# EAGLE schematic MSSRP-BATT (EAGLE 6.6.0)
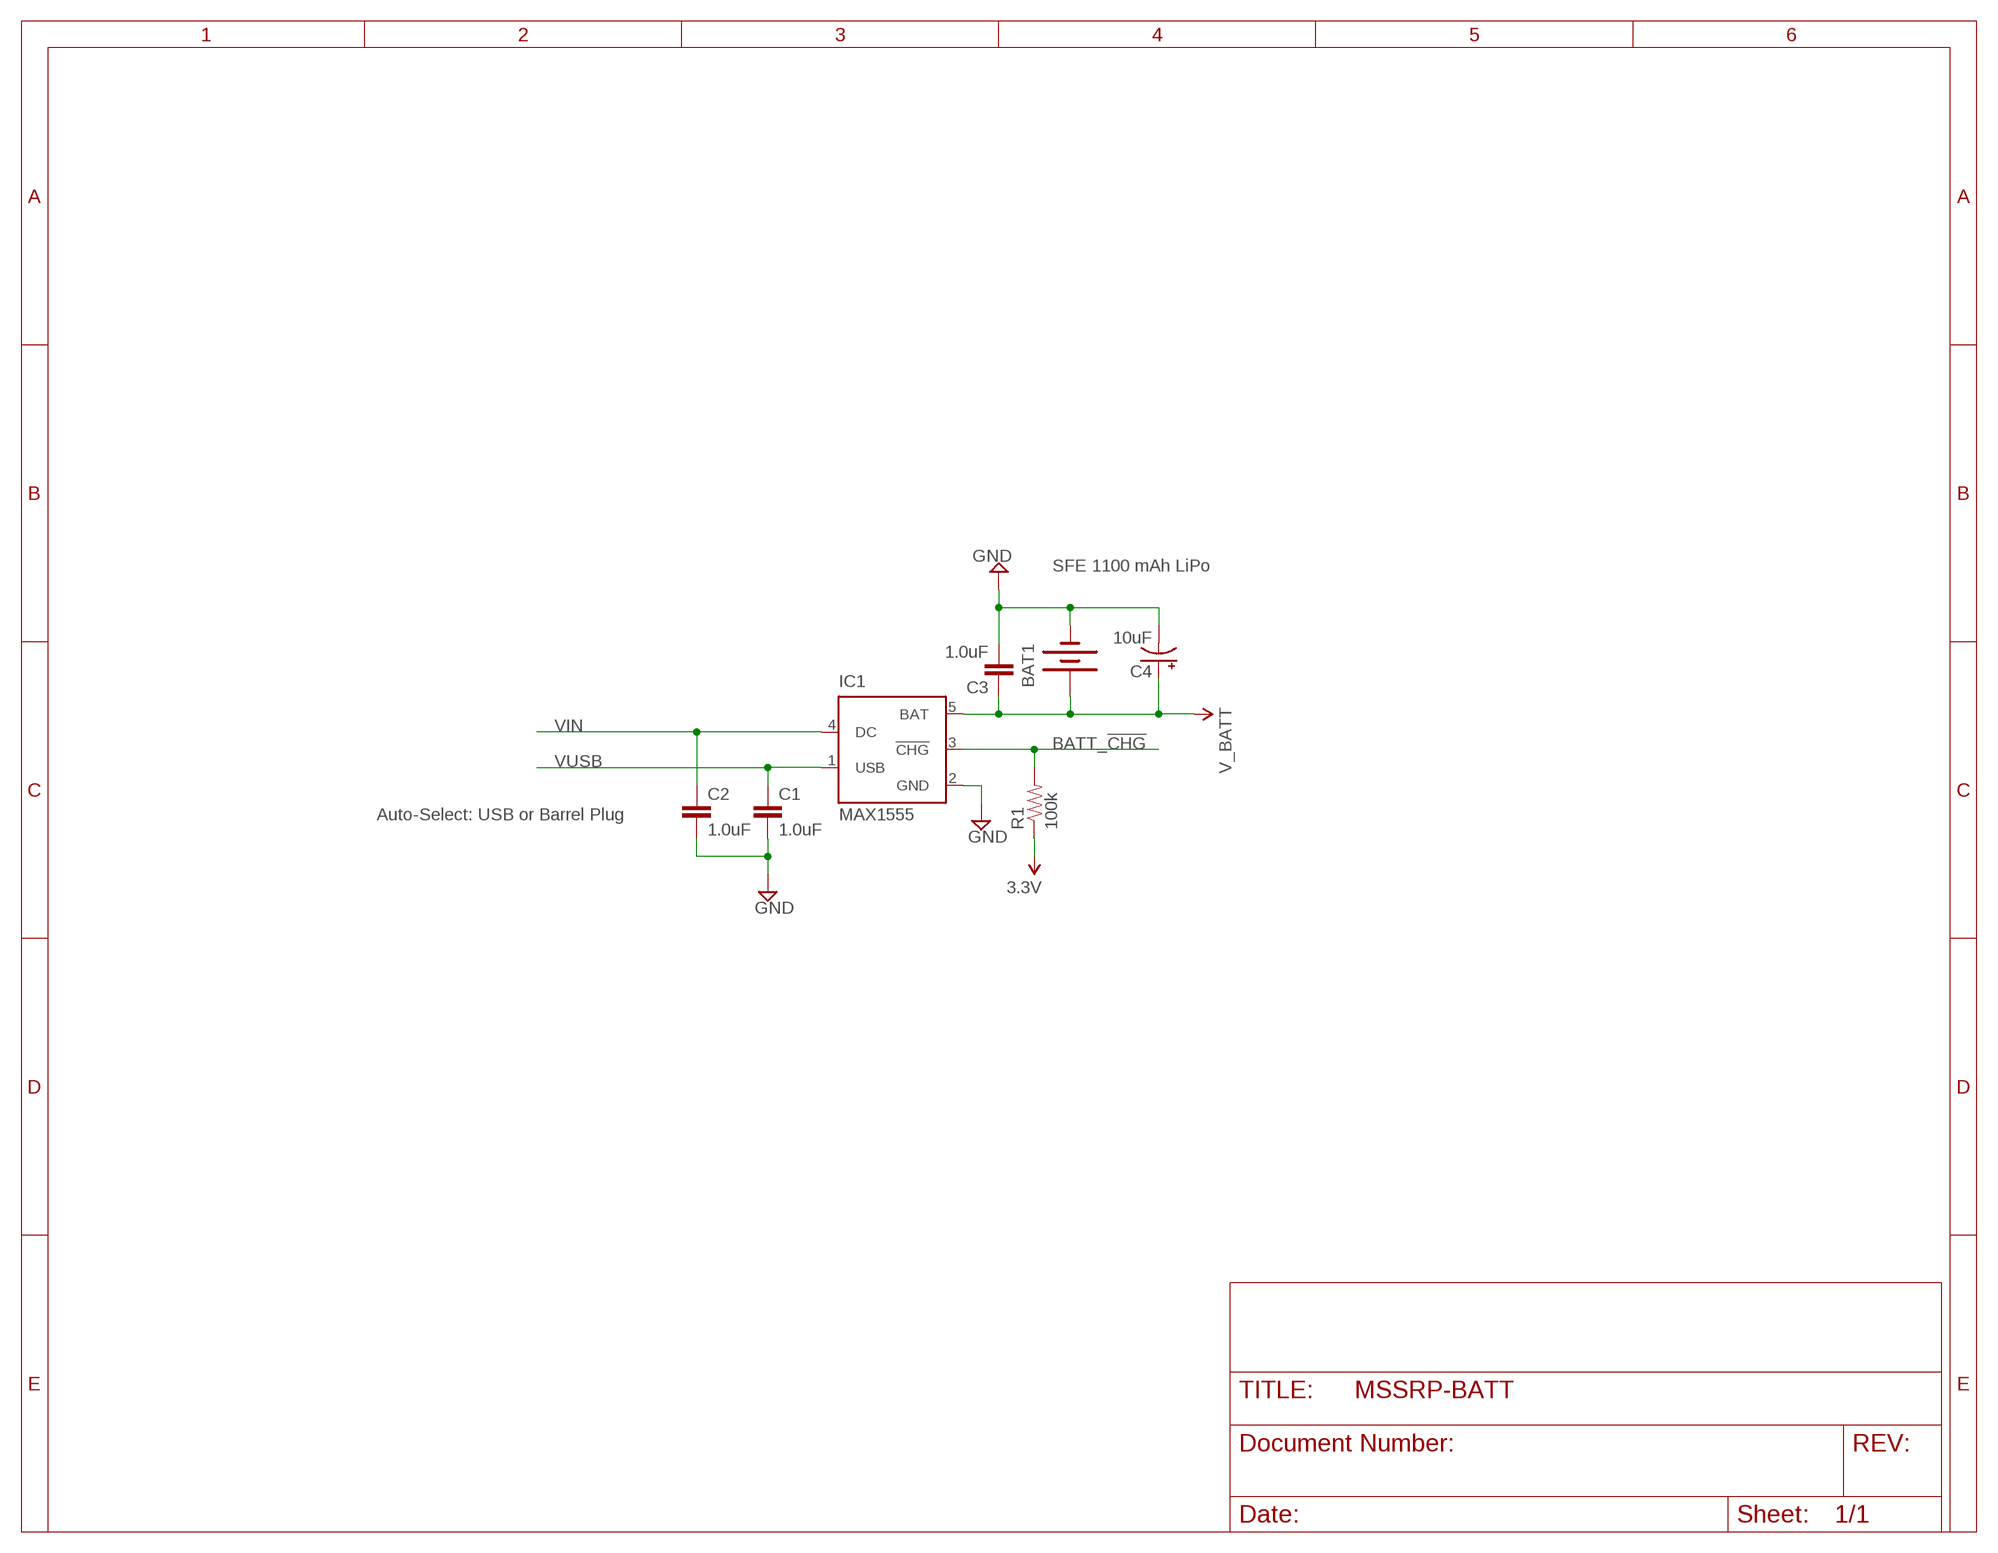
[diagram p0: schematic, sheet 1]

## Parts
BAT1  BATTERY1100  [LIPO-1100MAH]
C1  1.0uF  1.0UF-16V-10%(0603)  [0603-CAP]
C2  1.0uF  1.0UF-16V-10%(0603)  [0603-CAP]
C3  1.0uF  1.0UF-16V-10%(0603)  [0603-CAP]
C4  10uF  10UF-16V-10%(TANT)  [EIA3216]
IC1  MAX1555  [SOT23-5L]
R1  100k  100KOHM1/10W1%(0603)  [0603-RES]

## Nets
3.3V: R1.1
BATT_!CHG: IC1.3(!CHG) R1.2
GND: BAT1.- C1.2 C2.2 C3.2 C4.C(-) IC1.2(GND)
V_BATT: BAT1.+ C3.1 C4.A(+) IC1.5(BAT)
VIN: C2.1 IC1.4(DC)
VUSB: C1.1 IC1.1(USB)

## Notes on the sheet
- SFE 1100 mAh LiPo
- Auto-Select: USB or Barrel Plug

## Library data of the parts
BAT1 = SparkFun-Electromechanical:BATTERY: Battery Holders Various common sizes : AA, AAA, 20mm coin cell and 12mm coin cell. 20MM_4LEGS, BATT-10373
C1-C3 = SparkFun-Capacitors:1.0UF-16V-10%(0603): CAP-00868; PROD_ID: CAP-00868
C4 = SparkFun-Capacitors:10UF-16V-10%(TANT): CAP-00811 1206/EIA-3216 Tantalum capacitor; PROD_ID: CAP-00811
IC1 = maxim:MAX1555: Dual-Input USB/AC Adapter 1-Cell Li+ Battery Chargers Source: http://www.maxim-ic.com .. MAX1551-MAX1555.pdf; MF: MAXIM; MPN: MAX1555EZK+T; OC_FARNELL: 1628222; OC_NEWARK: 59J2761
R1 = SparkFun-Resistors:100KOHM1/10W1%(0603): RES-07828; PROD_ID: RES-07828